# Altium schematic sheet Sheet_lm12to5.SchDoc
size A4; SheetNumber: 1; SheetTotal: 1
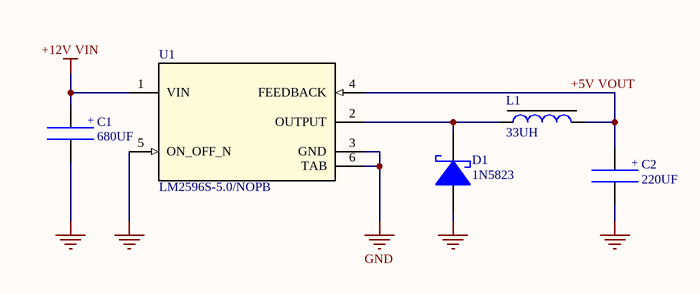
[diagram p0: Sheet_lm12to5.SchDoc]

## Parts
C1  680UF  [ESY687M025AH4AA]
C2  220UF  [35ZLJ220M8X16]
D1  1N5823  [DIODE_1N5823_SSM]
L1  33UH  [7447706330]
U1  LM2596S-5.0/NOPB  [LM2596]

## Nets
+12V VIN: C1.1(+) U1.1(VIN)
GND: C1.2 C2.2 D1.2(K) U1.3(GND) U1.5(ON_OFF_N) U1.6(TAB)
+5V VOUT: C2.1(+) L1.2 U1.4(FEEDBACK)
NetD1_1: D1.1(A) L1.1 U1.2(OUTPUT)

## Library data of the parts
C1 = ESY687M025AH4AA: CAP ALUM 680UF 20% 25V RADIAL TH
C2 = 35ZLJ220M8X16: CAP ALUM 220UF 20% 35V RADIAL TH
D1 = 1N5823: DIODE SCHOTTKY 20V 5A AXIAL
L1 = 7447706330: FIXED IND 33UH 3A 60 MOHM SMD
U1 = LM2596S-5.0NOPB: SIMPLE SWITCHER&reg; 4.5V to 40V, 3A Low Component Count Step-Down Regulator 5-DDPAK/TO-263; Manufacturer_Name: Texas Instruments; PartNumber: LM2596SX-ADJ/NOPB; Alternate_PartNumber: LM2596S-ADJ/NOPB; CompType: IC; TYPE: TYPE; RefDes: RefDes; Copyright: Copyright (C) 2025 Ultra Librarian. All rights reserved.; Manufacturer_Part_Number: LM2596S-5.0/NOPB; PackageReference: KTT0005B; MountType: SMT; RoHS: Y; Manufacturer: Texas Instruments